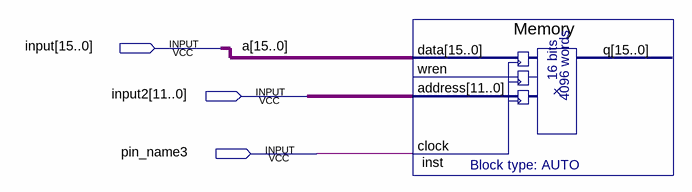
[diagram p0: schematic sheet]
// Quartus schematic test.bdf as structural Verilog: 1 symbols, 3 pins
module test (
  input  [15:0] \input ,
  input  [11:0] input2,
  input  pin_name3
);

  Memory inst (.data(\input ), .address(input2), .clock(pin_name3));  // open: wren, q

  // Other names for the same wires on the sheet: a[15:0] = \input 
endmodule
